# EAGLE design OSSIEPSNew (EAGLE 6.1)

## Sheet 1 of 3
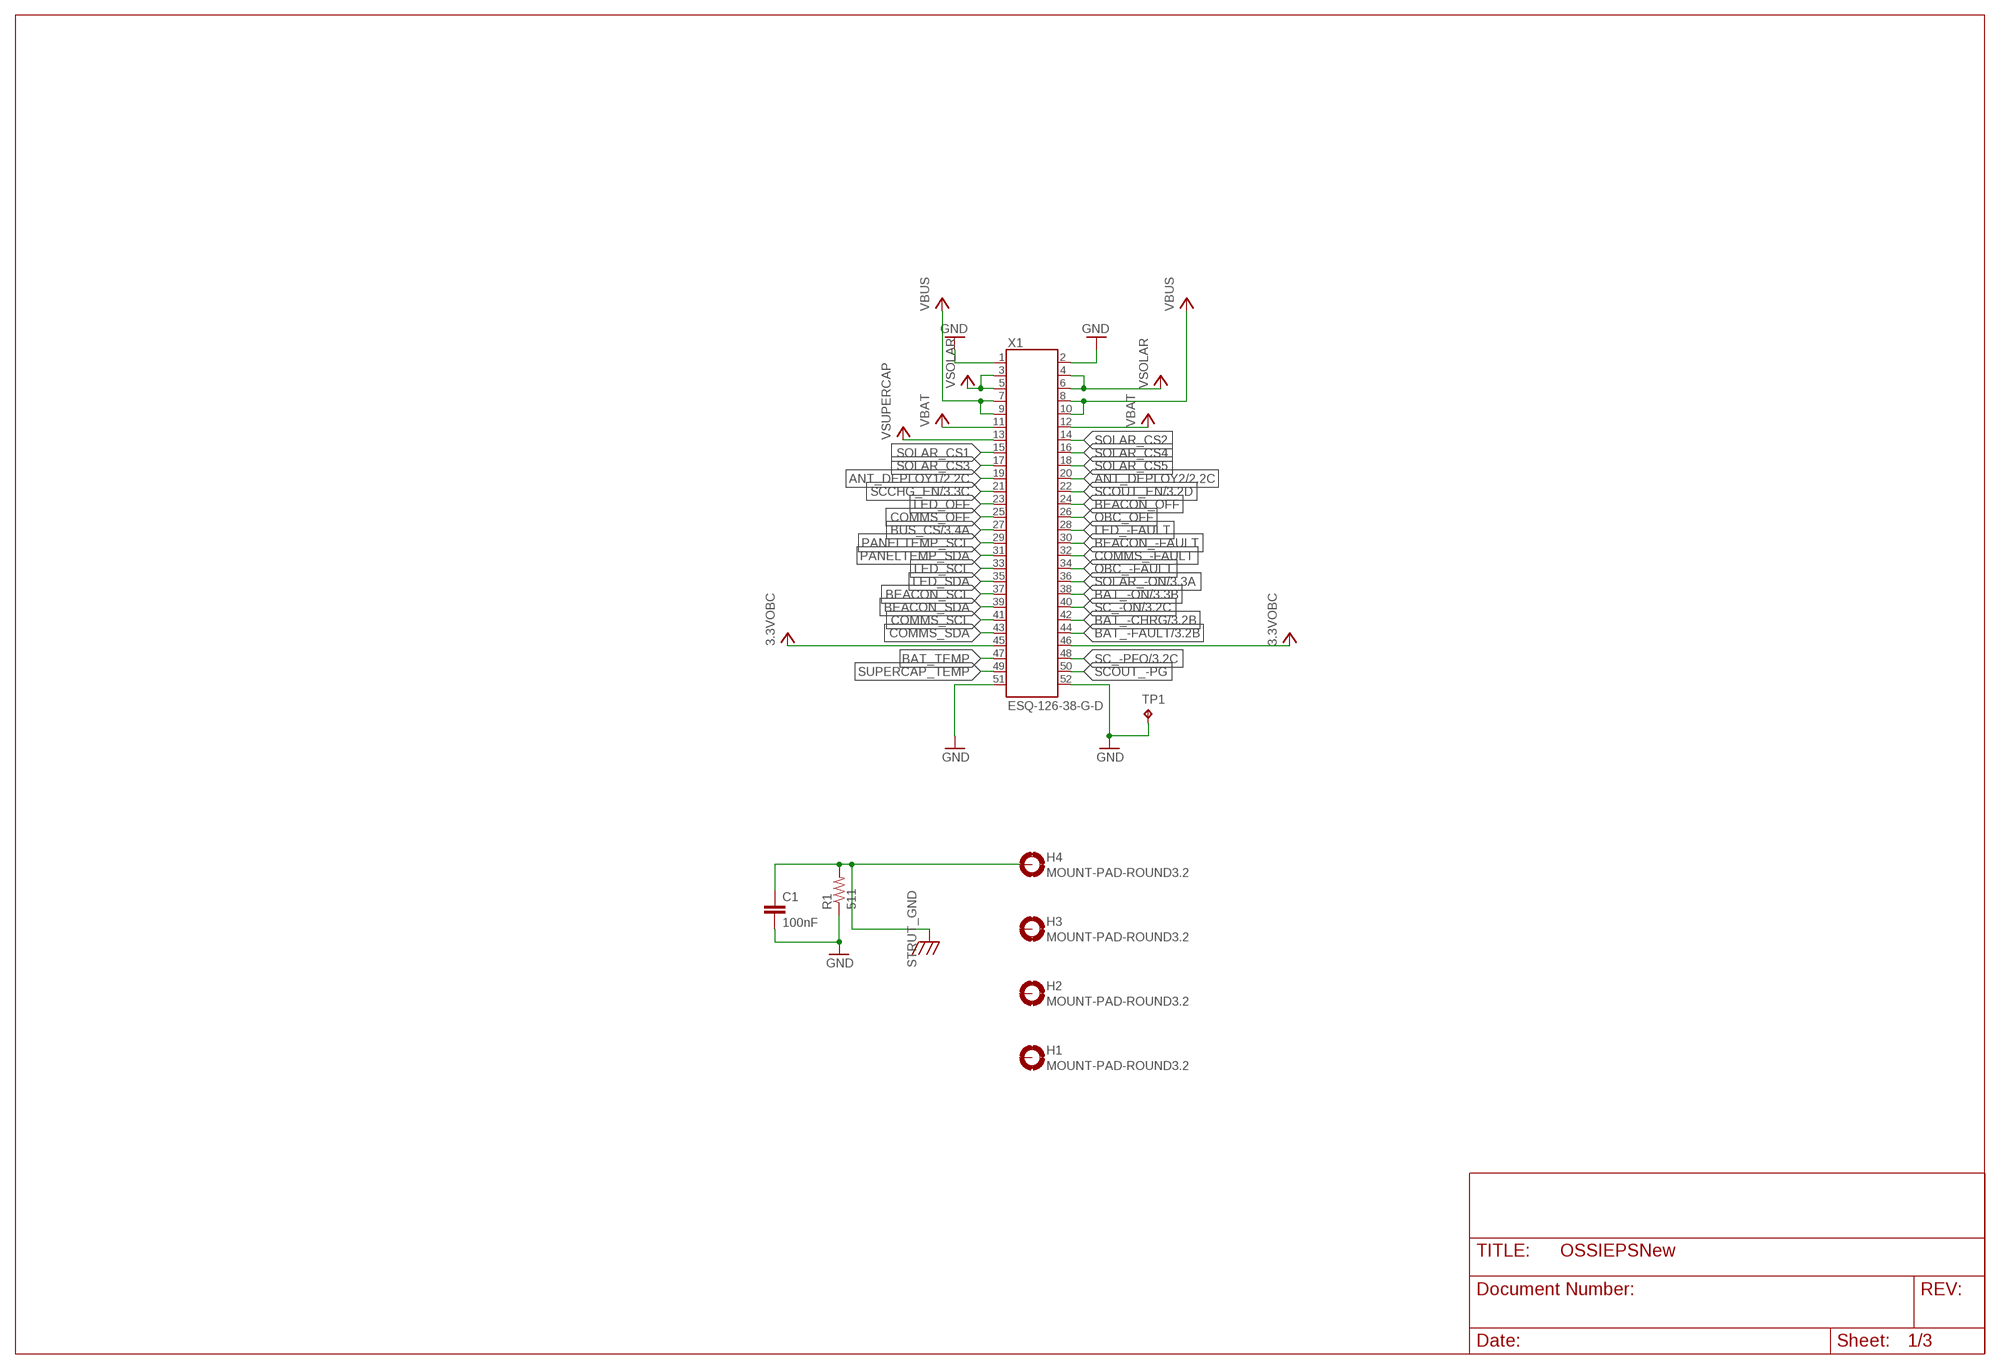
[diagram p0: schematic, sheet 1]

### Parts
C1  100nF  C0805(2012)  [C0805(2012)]
H1  MOUNT-PAD-ROUND3.2  [3.2-PAD-ROUND]
H2  MOUNT-PAD-ROUND3.2  [3.2-PAD-ROUND]
H3  MOUNT-PAD-ROUND3.2  [3.2-PAD-ROUND]
H4  MOUNT-PAD-ROUND3.2  [3.2-PAD-ROUND]
R1  511  RWSL1206  [WSL1206]
TP1  TP  [TP-13]
X1  ESQ-126-38-G-D  [ESQ-126-XX-X-D]

### Nets
3.3VOBC: X1.45 X1.46 ; also sheet 3
ANT_DEPLOY1: X1.19 ; also sheet 2
ANT_DEPLOY2: X1.20 ; also sheet 2
BAT_-CHRG: X1.42 ; also sheet 3
BAT_-FAULT: X1.44 ; also sheet 3
BAT_-ON: X1.38 ; also sheet 3
BAT_TEMP: X1.47
BEACON_-FAULT: X1.30
BEACON_OFF: X1.24
BEACON_SCL: X1.37
BEACON_SDA: X1.39
BUS_CS: X1.27 ; also sheet 3
COMMS_-FAULT: X1.32
COMMS_OFF: X1.25
COMMS_SCL: X1.41
COMMS_SDA: X1.43
GND: C1.2 R1.P$1 TP1.TP X1.1 X1.2 X1.51 X1.52 ; also sheet 2,3
LED_-FAULT: X1.28
LED_OFF: X1.23
LED_SCL: X1.33
LED_SDA: X1.35
OBC_-FAULT: X1.34
OBC_OFF: X1.26
PANELTEMP_SCL: X1.29
PANELTEMP_SDA: X1.31
SC_-ON: X1.40 ; also sheet 3
SC_-PFO: X1.48 ; also sheet 3
SCCHG_EN: X1.21 ; also sheet 3
SCOUT_-PG: X1.50
SCOUT_EN: X1.22 ; also sheet 3
SOLAR_-ON: X1.36 ; also sheet 3
SOLAR_CS1: X1.15
SOLAR_CS2: X1.14
SOLAR_CS3: X1.17
SOLAR_CS4: X1.16
SOLAR_CS5: X1.18
STRUT_GND: C1.1 H4.B3,2(MOUNT) R1.P$2
SUPERCAP_TEMP: X1.49
VBAT: X1.11 X1.12 ; also sheet 2,3
VBUS: X1.7 X1.8 X1.9 X1.10 ; also sheet 3
VSOLAR: X1.3 X1.4 X1.5 X1.6 ; also sheet 3
VSUPERCAP: X1.13 ; also sheet 3
Unconnected: H1.B3,2(MOUNT) H2.B3,2(MOUNT) H3.B3,2(MOUNT)

## Sheet 2 of 3
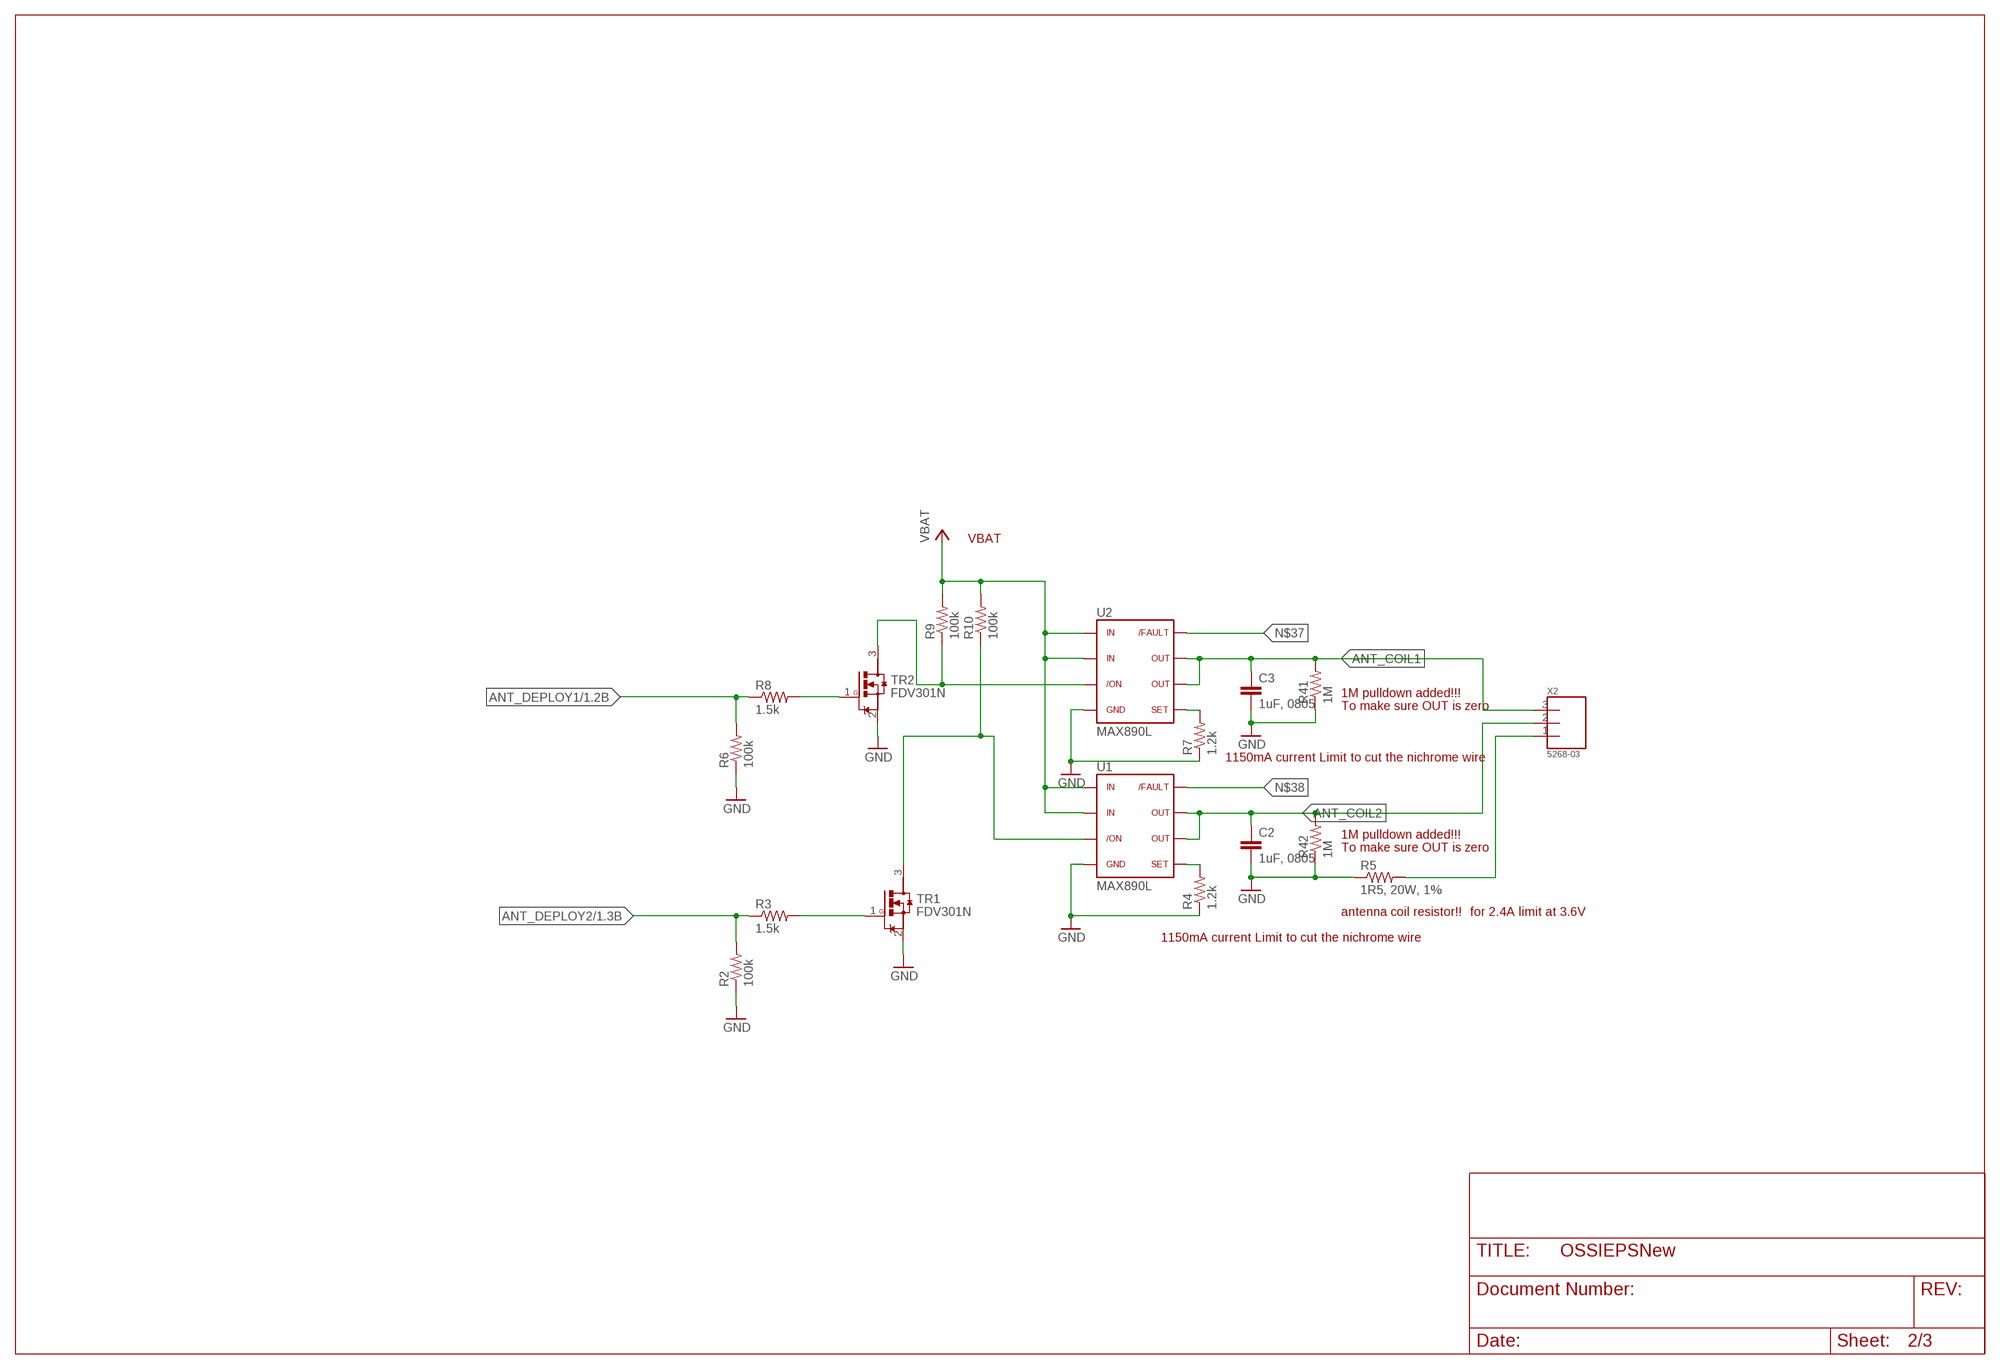
[diagram p1: schematic, sheet 2]

### Parts
C2  1uF, 0805  C0805(2012)  [C0805(2012)]
C3  1uF, 0805  C0805(2012)  [C0805(2012)]
R2  100k  R0603(1608)  [R0603(1608)]
R3  1.5k  R0603(1608)  [R0603(1608)]
R4  1.2k  R0603(1608)  [R0603(1608)]
R5  1R5, 20W, 1%  RPWR263S  [PWR263S-20]
R6  100k  R0603(1608)  [R0603(1608)]
R7  1.2k  R0603(1608)  [R0603(1608)]
R8  1.5k  R0603(1608)  [R0603(1608)]
R9  100k  R0603(1608)  [R0603(1608)]
R10  100k  R0603(1608)  [R0603(1608)]
R41  1M  R0603(1608)  [R0603(1608)]
R42  1M  R0603(1608)  [R0603(1608)]
TR1  FDV301N  [SOT23]
TR2  FDV301N  [SOT23]
U1  MAX890L  [SO8]
U2  MAX890L  [SO8]
X2  5268-03  [5268-03]

### Nets
ANT_COIL1: C3.1 R41.2 U2.6 U2.7 X2.3
ANT_COIL2: C2.1 R42.2 U1.6 U1.7 X2.2
ANT_DEPLOY1: R6.2 R8.1 ; also sheet 1
ANT_DEPLOY2: R2.2 R3.1 ; also sheet 1
GND: C2.2 C3.2 R2.1 R4.1 R5.P$1 R6.1 R7.1 R41.1 R42.1 TR1.2(S) TR2.2(S) U1.4 U2.4 ; also sheet 1,3
N$33: R3.2 TR1.1(G)
N$37: U2.8
N$38: U1.8
N$49: R8.2 TR2.1(G)
N$50: R9.1 TR2.3(D) U2.3
N$51: R10.1 TR1.3(D) U1.3
N$52: R7.2 U2.5
N$53: R4.2 U1.5
N$57: R5.P$2 X2.1
VBAT: R9.2 R10.2 U1.1 U1.2 U2.1 U2.2 ; also sheet 1,3

### Notes on the sheet
- VBAT
- 1M pulldown added!!!
- To make sure OUT is zero
- 1150mA current Limit to cut the nichrome wire
- 1M pulldown added!!!
- To make sure OUT is zero
- antenna coil resistor!! | for 2.4A limit at 3.6V
- 1150mA current Limit to cut the nichrome wire

## Sheet 3 of 3
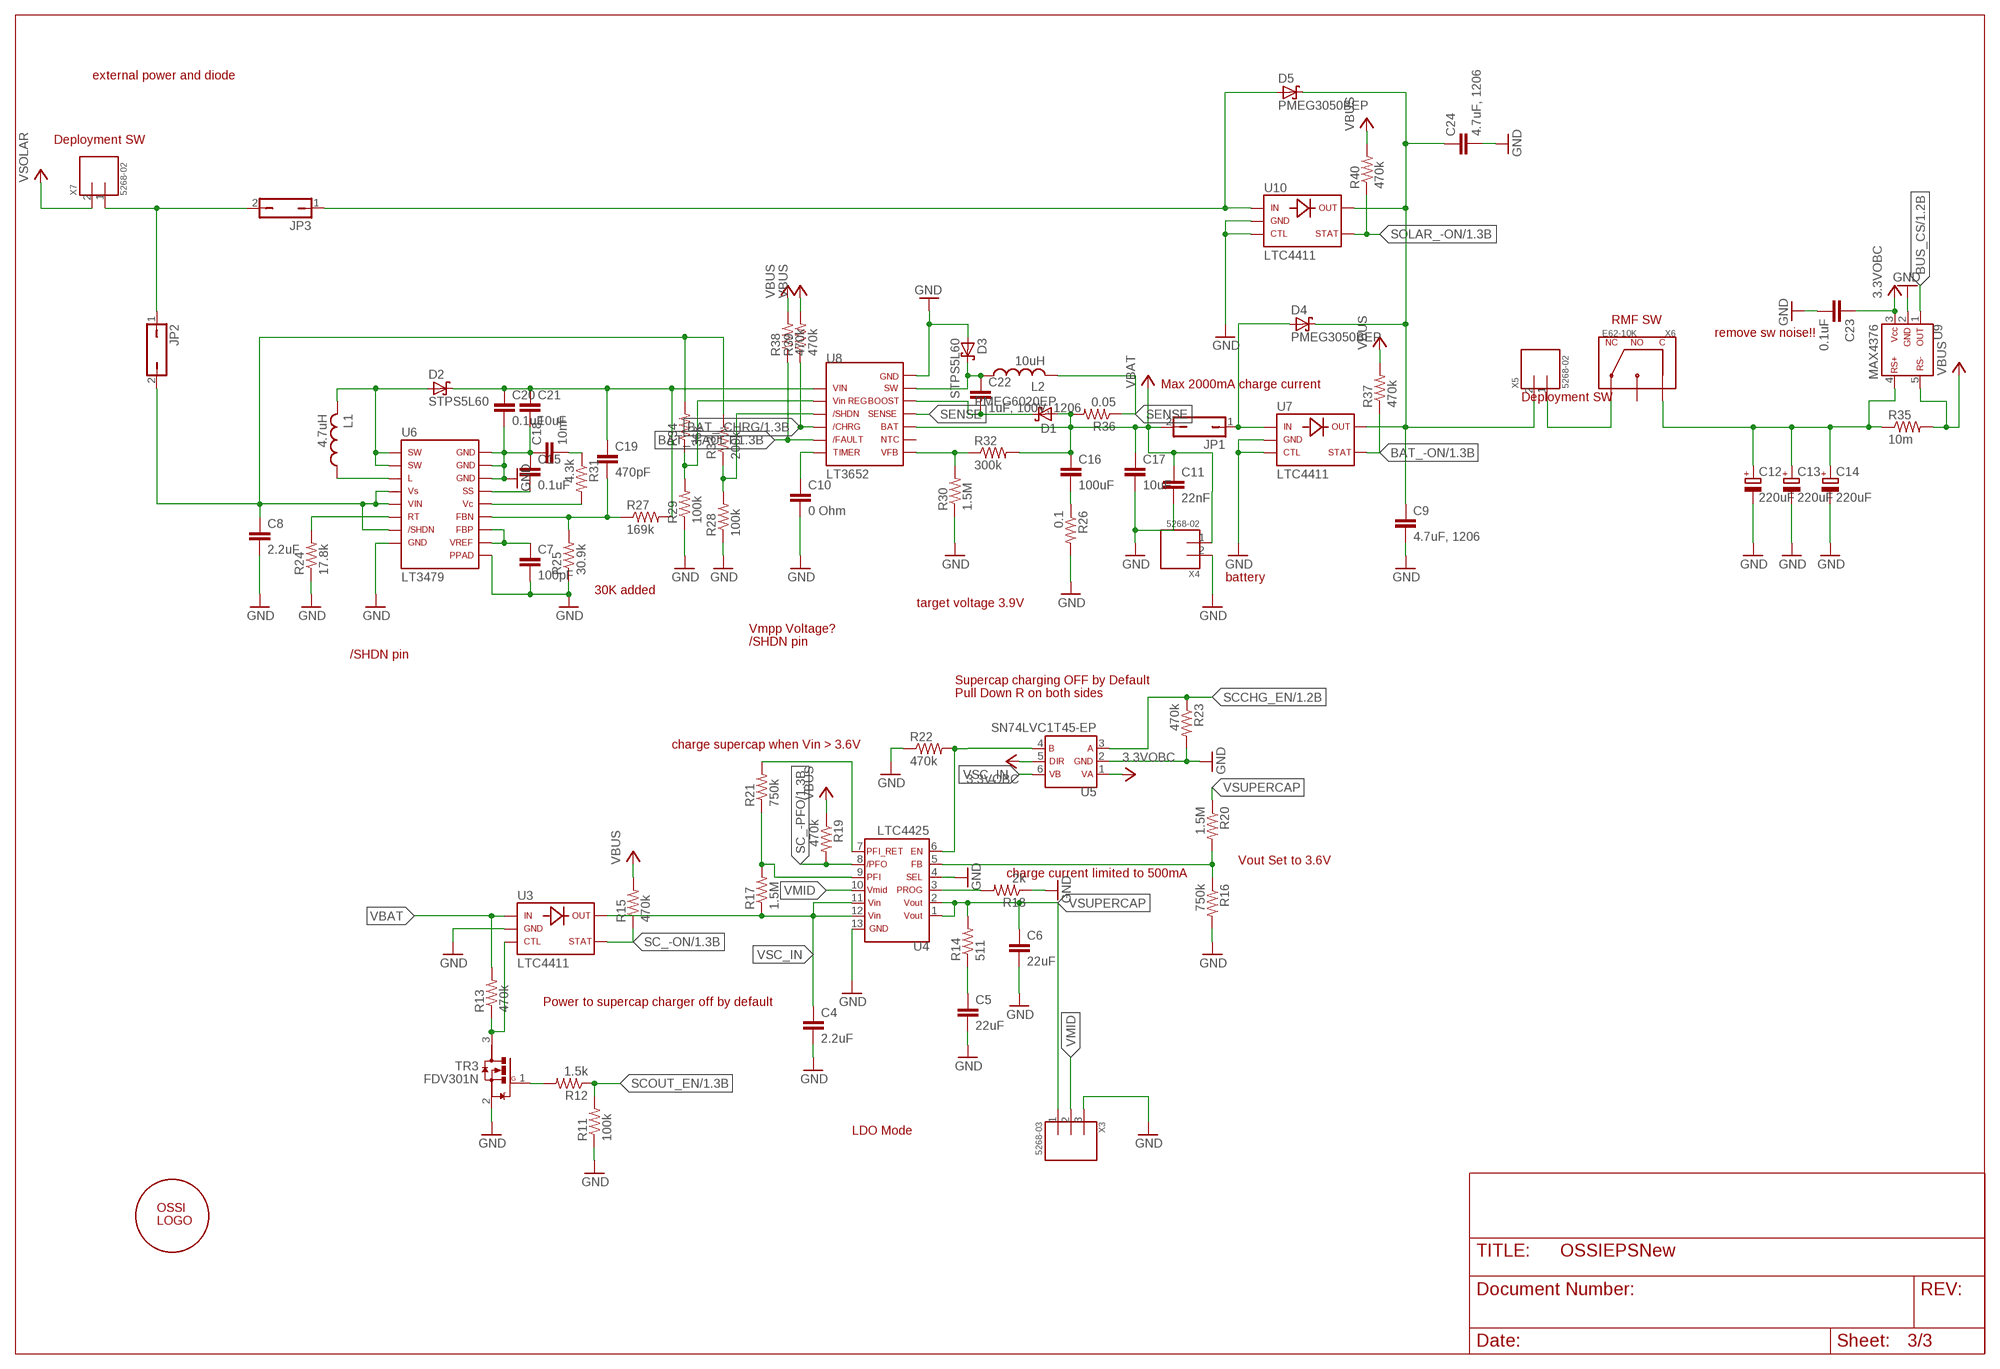
[diagram p2: schematic, sheet 3]

### Parts
C4  2.2uF  C1206(3216)-GCM31  [C1206-GCM31]
C5  22uF  C1210(3225)-GCM32  [C1210-GCM32]
C6  22uF  C1210(3225)-GCM32  [C1210-GCM32]
C7  100pF  C0603(1608)  [C0603(1608)]
C8  2.2uF  C1206(3216)-GCM31  [C1206-GCM31]
C9  4.7uF, 1206  C1206(3216)-GCM31  [C1206-GCM31]
C10  0 Ohm  C0603(1608)  [C0603(1608)]
C11  22nF  C0603(1608)  [C0603(1608)]
C12  220uF  C-TANTAL-Y  [C2917(7343)-Y]
C13  220uF  C-TANTAL-Y  [C2917(7343)-Y]
C14  220uF  C-TANTAL-Y  [C2917(7343)-Y]
C15  0.1uF  C0603(1608)  [C0603(1608)]
C16  100uF  C1210(3225)-TMK325  [C1210-TMK325]
C17  10uF  C1210(3225)-GCM32  [C1210-GCM32]
C18  10nF  C0603(1608)  [C0603(1608)]
C19  470pF  C0603(1608)  [C0603(1608)]
C20  0.1uF  C0603(1608)  [C0603(1608)]
C21  10uF  C1210(3225)-GCM32  [C1210-GCM32]
C22  1uF, 100V, 1206  C0805(2012)  [C0805(2012)]
C23  0.1uF  C0603(1608)  [C0603(1608)]
C24  4.7uF, 1206  C1206(3216)-GCM31  [C1206-GCM31]
D1  PMEG6020EP  [PMEG6020EP]
D2  STPS5L60  [STPS5L60]
D3  STPS5L60  [STPS5L60]
D4  PMEG3050BEP  PMEG6020EP  [PMEG6020EP]
D5  PMEG3050BEP  PMEG6020EP  [PMEG6020EP]
JP1  JP1Q  [JP1]
JP2  JP1Q  [JP1]
JP3  JP1Q  [JP1]
L1  4.7uH  LRLF7030  [RLF7030]
L2  10uH  LRLF12545  [RLF12545]
R11  100k  R0603(1608)  [R0603(1608)]
R12  1.5k  R0603(1608)  [R0603(1608)]
R13  470k  R0603(1608)  [R0603(1608)]
R14  511  RWSL1206  [WSL1206]
R15  470k  R0603(1608)  [R0603(1608)]
R16  750k  R0603(1608)  [R0603(1608)]
R17  1.5M  R0603(1608)  [R0603(1608)]
R18  2k  R0603(1608)  [R0603(1608)]
R19  470k  R0603(1608)  [R0603(1608)]
R20  1.5M  R0603(1608)  [R0603(1608)]
R21  750k  R0603(1608)  [R0603(1608)]
R22  470k  R0603(1608)  [R0603(1608)]
R23  470k  R0603(1608)  [R0603(1608)]
R24  17.8k  R0603(1608)  [R0603(1608)]
R25  30.9k  R0603(1608)  [R0603(1608)]
R26  0.1  RWSL1206  [WSL1206]
R27  169k  R0603(1608)  [R0603(1608)]
R28  100k  R0603(1608)  [R0603(1608)]
R29  100k  R0603(1608)  [R0603(1608)]
R30  1.5M  R0603(1608)  [R0603(1608)]
R31  4.3k  R0603(1608)  [R0603(1608)]
R32  300k  R0603(1608)  [R0603(1608)]
R33  200k  R0603(1608)  [R0603(1608)]
R34  36k  R0603(1608)  [R0603(1608)]
R35  10m  RWSL1206  [WSL1206]
R36  0.05  RWSL1206  [WSL1206]
R37  470k  R0603(1608)  [R0603(1608)]
R38  470k  R0603(1608)  [R0603(1608)]
R39  470k  R0603(1608)  [R0603(1608)]
R40  470k  R0603(1608)  [R0603(1608)]
TR3  FDV301N  [SOT23]
U3  LTC4411  [TSOT23-5]
U4  LTC4425  [MSE]
U5  SN74LVC1T45-EP  [SOT-6DCK]
U6  LT3479  [TSSOP16-FE]
U7  LTC4411  [TSOT23-5]
U8  LT3652  [MSE]
U9  MAX4376  [SOT23-5DBV]
U10  LTC4411  [TSOT23-5]
U$1  OSSILOGORECT  [OSSILOGORECT1005]
X3  5268-03  [5268-03]
X4  5268-02  [5628-02]
X5  5268-02  [5628-02]
X6  E62-10K  [E62-10K]
X7  5268-02  [5628-02]

### Nets
3.3VOBC: C23.1 U5.1 U5.5 U9.3 ; also sheet 1
BAT_-CHRG: R39.1 U8.4 ; also sheet 1
BAT_-FAULT: R38.1 U8.5 ; also sheet 1
BAT_-ON: R37.1 U7.P$4 ; also sheet 1
BUS_CS: U9.1 ; also sheet 1
GND: C4.P$2 C5.P$2 C6.P$2 C7.2 C8.P$2 C9.P$2 C10.2 C11.2 C12.2(-) C13.2(-) C14.2(-) C15.1 C17.P$2 C18.1 C20.2 C21.P$2 C23.2 C24.P$2 D3.A R11.1 R16.2 R18.1 R22.1 R23.2 R24.1 R25.1 R26.P$2 R28.1 R29.1 R30.1 TR3.2(S) U3.P$2 U4.4 U4.13 U5.2 U6.8 U6.14 U6.15 U6.16 U6.PPAD U7.P$2 U7.P$3 U8.13 U9.2 U10.P$2 U10.P$3 X3.3 X4.2 ; also sheet 1,2
N$1: L1.P$1 U6.3
N$2: R29.2 R34.1 U8.2
N$3: C19.1 C20.1 C21.P$1 D2.C R27.2 U8.1
N$4: C16.P$2 R26.P$1
N$5: C15.2 U6.13
N$6: D2.A L1.P$2 U6.1 U6.2
N$7: C18.2 R31.1
N$8: R31.2 U6.12
N$9: C19.2 R25.2 R27.1 U6.11
N$10: C7.1 U6.9 U6.10
N$11: R24.2 U6.6
N$12: R28.2 R33.1 U8.3
N$13: C22.2 D1.C U8.11
N$14: R16.1 R20.2 U4.5
N$16: C22.1 D3.C L2.P$1 U8.12
N$17: R30.2 R32.1 U8.7
N$18: C9.P$1 C24.P$1 D4.C D5.C U7.P$5 U10.P$5 X5.2
N$19: C10.1 U8.6
N$20: R22.2 U4.6 U5.4
N$21: C5.P$1 R14.P$1
N$22: R13.1 TR3.3(D) U3.P$3
N$23: R12.2 TR3.1(G)
N$24: C12.1(+) C13.1(+) C14.1(+) R35.P$1 U9.4 X6.C
N$29: R17.2 R21.1 U4.9
N$31: R21.2 U4.7
N$39: D5.A JP3.1 U10.P$1
N$40: R18.2 U4.3
N$42: D4.A JP1.1 U7.P$1
N$44: C8.P$1 JP2.2 R33.2 R34.2 U6.4 U6.5 U6.7
N$46: JP2.1 JP3.2 X7.1
N$54: X5.1 X6.NC
SC_-ON: R15.1 U3.P$4 ; also sheet 1
SC_-PFO: R19.2 U4.8 ; also sheet 1
SCCHG_EN: R23.1 U5.3 ; also sheet 1
SCOUT_EN: R11.2 R12.1 ; also sheet 1
SENSE: L2.P$2 R36.P$1 U8.10
SOLAR_-ON: R40.1 U10.P$4 ; also sheet 1
VBAT: C11.1 C16.P$1 C17.P$1 D1.A JP1.2 R13.2 R32.2 R36.P$2 U3.P$1 U8.9 X4.1 ; also sheet 1,2
VBUS: R15.2 R19.1 R35.P$2 R37.2 R38.2 R39.2 R40.2 U9.5 ; also sheet 1
VMID: U4.10 X3.2
VSC_IN: C4.P$1 R17.1 U3.P$5 U4.11 U4.12 U5.6
VSOLAR: X7.2 ; also sheet 1
VSUPERCAP: C6.P$1 R14.P$2 R20.1 U4.1 U4.2 X3.1 ; also sheet 1
Unconnected: U8.8 X6.NO

### Notes on the sheet
- external power and diode
- Deployment SW
- RMF SW
- remove sw noise!!
- Max 2000mA charge current
- Deployment SW
- battery
- 30K added
- target voltage 3.9V
- Vmpp Voltage?
- /SHDN pin
- /SHDN pin
- Supercap charging OFF by Default
- Pull Down R on both sides
- charge supercap when Vin > 3.6V
- Vout Set to 3.6V
- charge current limited to 500mA
- Power to supercap charger off by default
- LDO Mode

## Library data of the parts
C1-C11 C15-C24 = OSSI:C
C12-C14 = OSSI:C-TANTAL-Y: TAJY227K010RNJ Taltal Capacitor manufacture: AVX 2917(7343)
D1 D4 D5 = OSSI:PMEG6020EP
D2 D3 = OSSI:STPS5L60: STPS5L60 If: 5A / Vrrm: 60V / Vf: 0.47V @ 5A
H1-H4 = OSSI:MOUNT-PAD-ROUND
JP1-JP3 = OSSI:JP1Q: JUMPER
L1 L2 = OSSI:L
R1-R42 = OSSI:R
TP1 = OSSI:TP
TR1-TR3 = OSSI:FDV301N: FDV301N Digital N channel - FET / Rdson = 5 Ohm / Vgs = 0.7~1.06V / Ids = 220mA
U1 U2 = OSSI:MAX890L: MAX 890L 1.2A, Current-Limited, High-Side P-Channel Switch with Thermal Shutdown BY MAXIM
U3 U7 U10 = OSSI:LTC4411: Linear Techonology LTC4411 ideal diode Small Regulated Forward Voltage (28mV) 2.6A Maximum Forward Current 2.6V to 5.5V Operating Range MOSFET based
U4 = OSSI:LTC4425: LTC4425 Linear SuperCap Charger With Current-Limited Ideal Diode and V/I Monitor
U5 = OSSI:SN74LVC1T45-EP: SN74LVC1T45-EP SINGLE-BIT DUAL-SUPPLY BUS TRANSCEIVER WITH CONFIGURABLE VOLTAGE TRANSLATION AND 3-STATE OUTPUTS
U6 = OSSI:LT3479: LT3479 inverting switching convertor Input Voltage Range: 2.5V to 24V 3A, 42V Internal Switch Efﬁciency Power Conversion: Up to 89% Soft-Start Frequency Set by External Resistor: 200kHz to 3.5MHz Protection Against Input Short Circuits and Hot Plugging
U8 = OSSI:LT3652: LT3652 Battery Charger Power Tracking 2A Battery Charger for Solar Power e Input Voltage Range: 4.95V to 32V (40V Abs Max) Programmable Charge Rate Up to 2A Programmable Float Voltage Up to 14.4V 1MHz Fixed Frequency
U9 = OSSI:MAX4376
U$1 = OSSI:OSSILOGO
X1 = OSSI:ESQ-126-: Samtec ESQ-126-XX-G-D Elevated Sockets Seires ESQ-126-37-G-D ESQ-126-38-G-D ESQ-126-39-G-D
X2 X3 = OSSI:5268-03
X4 X5 X7 = OSSI:5268-02
X6 = OSSI:E62-10K: Cherry E620-10K spdt sw for Remove Before Flight pin

## Board
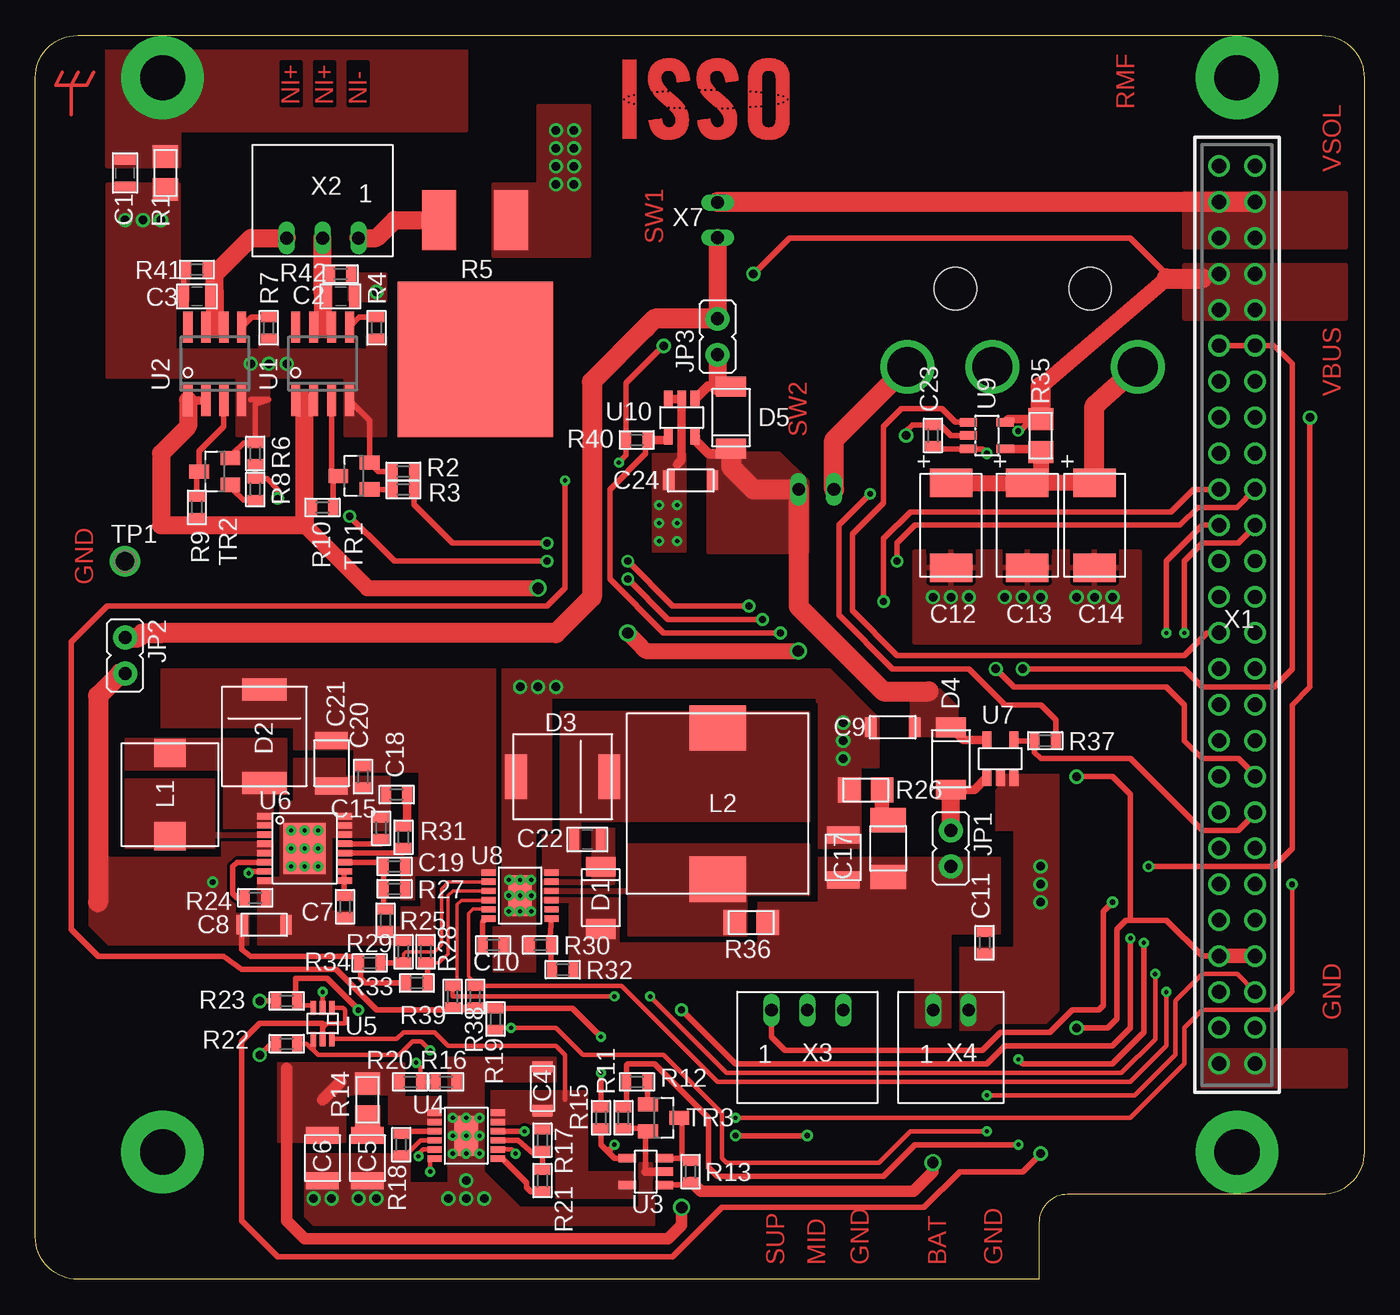
[diagram p3: board, top side]
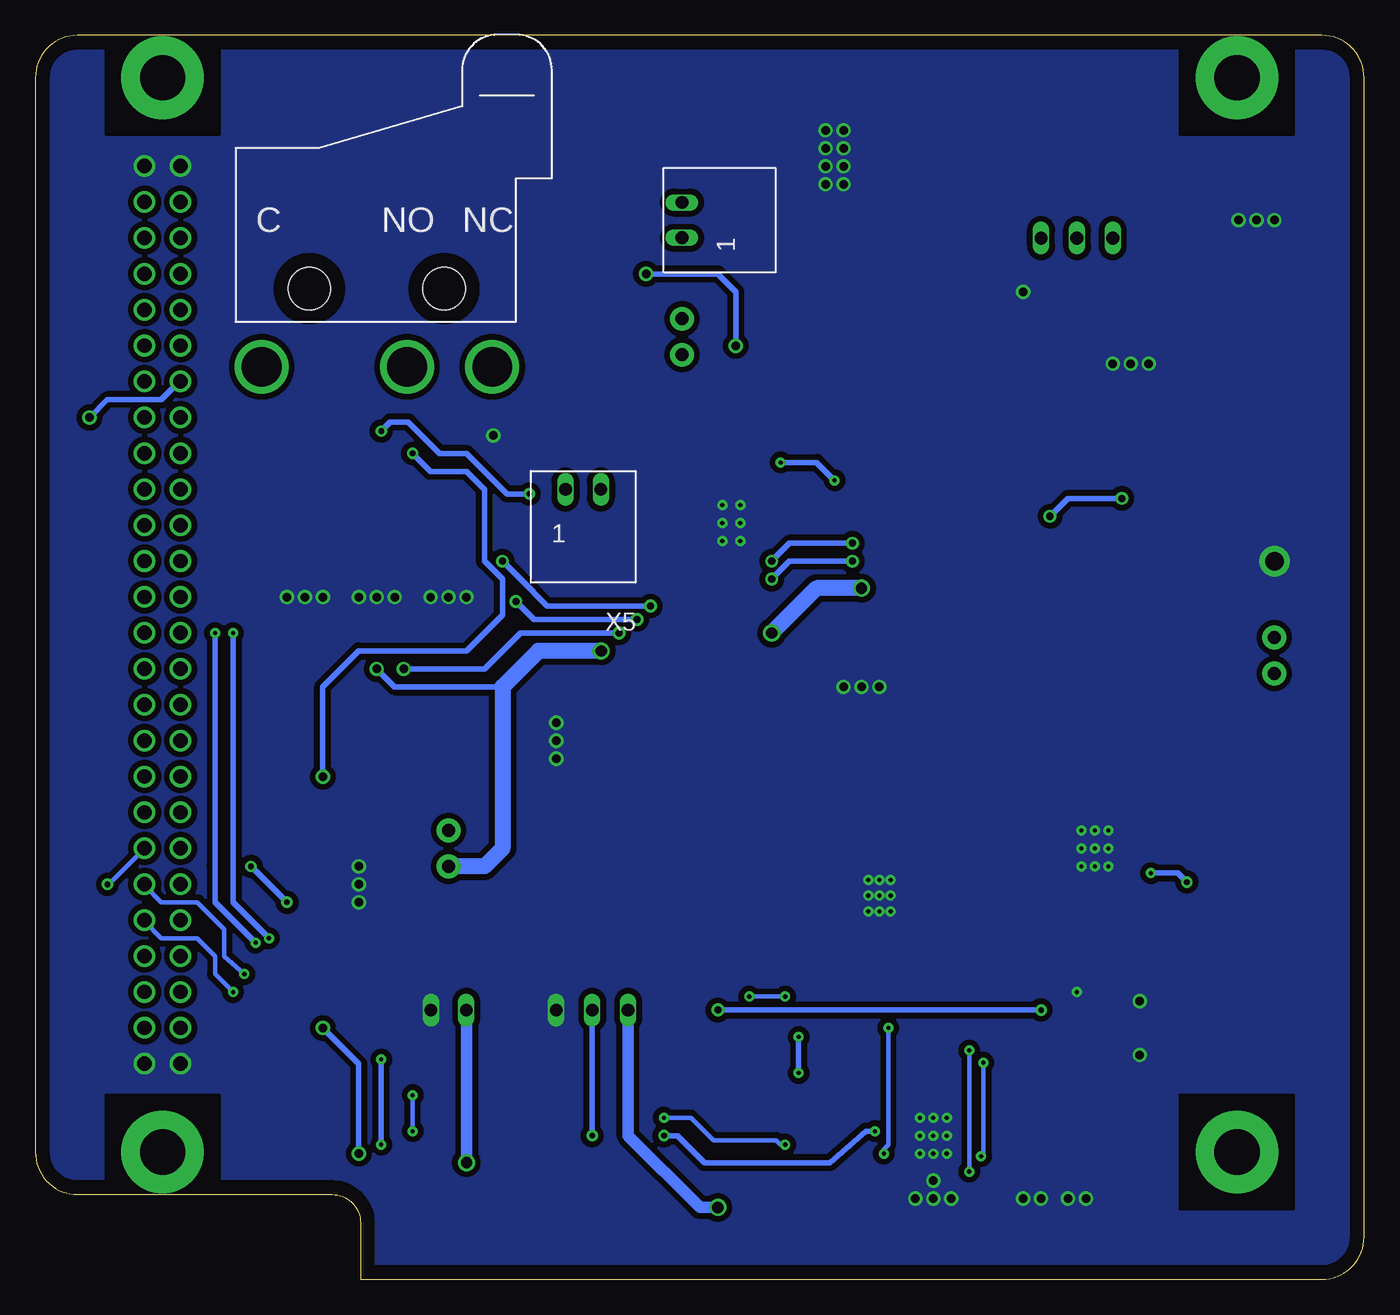
[diagram p4: board, bottom side, seen from below]

Size 94 x 88 mm. Coordinates in mm from the lower left corner, seen from the top.
Outline: 71,0 3,0 arc-90 0,3 0,85 arc-90 3,88 91,88 arc-90 94,85 94,9 arc-90 91,6 73,6 arc90 71,4 71,0
Copper layers (1*16): Top 0.035mm / dielectric 0.8mm / Bottom 0.035mm
Design rules "default": minimum track width 10mil, minimum drill 10mil, track to track 8mil, track to pad 8mil, pad to pad 8mil, via to via 8mil, smd to smd 8mil, copper to edge 40mil, drill to drill 8mil, minimum pad ring 5mil, minimum via ring 8mil, stop-mask expansion 4mil, vias tented up to drill 0mil, thermal gap 10mil

### Footprints (pad centres in the part's own frame; a part is rotated, then mirrored left to right if it is on the bottom)
C0805(2012) = smd 0.7 x 1.5: 1 -0.95,0; 2 0.95,0
C1206-GCM31 = smd 0.8 x 1.4: P$1 -1.55,0; P$2 1.55,0
C1210-GCM32 = smd 1.2 x 2.3: P$1 -1.6,0; P$2 1.6,0
C0603(1608) = smd 0.7 x 1.1: 1 -0.75,0; 2 0.75,0
C2917(7343)-Y = smd 2 x 3: 1 -3,0; 2 3,0
C1210-TMK325 = smd 1.7 x 2.5: P$1 -2,0; P$2 2,0
PMEG6020EP = smd 1.4 x 2.1: A -2.2,0; C 2.2,0
STPS5L60 = smd 1.54 x 3.14: A -3.3,0; C 3.3,0
3.2-PAD-ROUND = drill 3.2 pad 5.842: B3,2 0,0
JP1 = drill 0.914 pad 1.676: 1 0,-1.27; 2 0,1.27
RLF7030 = smd 2 x 2.2: P$1 -2.95,0; P$2 2.95,0
RLF12545 = smd 3.2 x 4: P$1 -5.35,0; P$2 5.35,0
WSL1206 = smd 1.57 x 1.78: P$1 -1.165,0; P$2 1.165,0
R0603(1608) = smd 0.7 x 1.1: 1 -0.75,0; 2 0.75,0
PWR263S-20 = smd 2.4 x 4.23: P$1 -2.54,0; P$2 2.54,0 | smd 11 x 11: TPAD 0,9.865
TP-13 = drill 1.321 pad 2.159: TP 0,0
SOT23 = smd 1 x 1.4: 1 -0.95,-1.1; 2 0.95,-1.1; 3 0,1.1
SO8 = smd 0.65 x 2.2: 1 -1.905,-2.6; 2 -0.635,-2.6; 3 0.635,-2.6; 4 1.905,-2.6; 5 1.905,2.6; 6 0.635,2.6; 7 -0.635,2.6; 8 -1.905,2.6
TSOT23-5 = smd 0.62 x 1.22: P$1 -0.95,-1.31; P$2 0,-1.31; P$3 0.95,-1.31; P$4 0.95,1.31; P$5 -0.95,1.31
MSE = smd 0.45 x 1: 1 -1.625,-2.233; 2 -0.975,-2.233; 3 -0.325,-2.233; 4 0.325,-2.233; 5 0.975,-2.233; 6 1.625,-2.233; 7 1.625,2.233; 8 0.975,2.233; 9 0.325,2.233; 10 -0.325,2.233; 11 -0.975,2.233; 12 -1.625,2.233 | smd 2.845 x 1.65: 13 0,0
SOT-6DCK = smd 0.4 x 1: 1 -0.65,-1.1; 2 0,-1.1; 3 0.65,-1.1; 4 0.65,1.1; 5 0,1.1; 6 -0.65,1.1
TSSOP16-FE = smd 0.45 x 1.1: 1 -2.275,-2.8; 2 -1.625,-2.8; 3 -0.975,-2.8; 4 -0.325,-2.8; 5 0.325,-2.8; 6 0.975,-2.8; 7 1.625,-2.8; 8 2.275,-2.8; 9 2.275,2.8; 10 1.625,2.8; 11 0.975,2.8; 12 0.325,2.8; 13 -0.325,2.8; 14 -0.975,2.8; 15 -1.625,2.8; 16 -2.275,2.8 | smd 3.58 x 2.94: PPAD 0,0
SOT23-5DBV = smd 0.6 x 1.22: 1 -0.95,-1.3; 2 0,-1.3; 3 0.95,-1.3; 4 0.95,1.3; 5 -0.95,1.3
ESQ-126-XX-X-D = drill 1.016 pad 1.524: 1 -1.27,31.75; 2 1.27,31.75; 3 -1.27,29.21; 4 1.27,29.21; 5 -1.27,26.67; 6 1.27,26.67; 7 -1.27,24.13; 8 1.27,24.13; 9 -1.27,21.59; 10 1.27,21.59; 11 -1.27,19.05; 12 1.27,19.05; 13 -1.27,16.51; 14 1.27,16.51; 15 -1.27,13.97; 16 1.27,13.97; 17 -1.27,11.43; 18 1.27,11.43; 19 -1.27,8.89; 20 1.27,8.89; 21 -1.27,6.35; 22 1.27,6.35; 23 -1.27,3.81; 24 1.27,3.81; 25 -1.27,1.27; 26 1.27,1.27; 27 -1.27,-1.27; 28 1.27,-1.27; 29 -1.27,-3.81; 30 1.27,-3.81; 31 -1.27,-6.35; 32 1.27,-6.35; 33 -1.27,-8.89; 34 1.27,-8.89; 35 -1.27,-11.43; 36 1.27,-11.43; 37 -1.27,-13.97; 38 1.27,-13.97; 39 -1.27,-16.51; 40 1.27,-16.51; 41 -1.27,-19.05; 42 1.27,-19.05; 43 -1.27,-21.59; 44 1.27,-21.59; 45 -1.27,-24.13; 46 1.27,-24.13; 47 -1.27,-26.67; 48 1.27,-26.67; 49 -1.27,-29.21; 50 1.27,-29.21; 51 -1.27,-31.75; 52 1.27,-31.75
5268-03 = drill 0.9 long: 1 2.54,0; 2 0,0; 3 -2.54,0
5628-02 = drill 0.9 long: 1 1.25,0; 2 -1.25,0
E62-10K = drill 2.8 pad 3.81: C -17.99,-3.18; NC -1.68,-3.18; NO -7.7,-3.18 | hole 3: -5.08,2.36; -14.61,2.36

### Placement (x,y rotation side)
C1  6.35,78.26 270 top
C2  21.59,69.53 0 top
C3  11.43,69.53 180 top
C4  35.88,13.48 90 top
C5  23.5,8.57 270 top
C6  20.31,8.57 270 top
C7  21.91,26.35 270 top
C8  16.19,25.08 0 top
C9  60.64,39.05 180 top
C10  32.38,23.65 0 top
C11  67.15,23.81 270 top
C12  64.77,53.34 270 top
C13  70.17,53.34 270 top
C14  74.93,53.34 270 top
C15  24.45,31.91 270 top
C16  60.33,30.48 90 top
C17  57.15,29.84 90 top
C18  25.56,34.29 0 top
C19  25.4,29.21 180 top
C20  23.18,35.56 270 top
C21  20.95,36.51 270 top
C22  39.05,31.11 0 top
C23  63.5,59.69 90 top
C24  46.35,56.52 180 top
D1  40.01,26.99 90 top
D2  16.19,38.42 90 top
D3  37.31,35.56 0 top
D4  64.77,36.83 90 top
D5  49.21,60.96 270 top
H1  9,9 0 top
H2  85,9 0 top
H3  85,85 0 top
H4  9,85 0 top
JP1  64.77,30.48 180 top
JP2  6.35,44.13 180 top
JP3  48.26,66.67 0 top
L1  9.53,34.29 90 top
L2  48.26,33.66 270 top
R1  9.21,78.26 90 top
R2  26.04,57.15 0 top
R3  26.04,55.88 180 top
R4  24.13,67.31 90 top
R5  31.11,74.93 180 top
R6  15.56,58.42 270 top
R7  16.51,67.31 90 top
R8  15.56,55.88 270 top
R9  11.43,54.61 270 top
R10  20.32,54.61 180 top
R11  41.59,11.43 90 top
R12  42.56,13.97 0 top
R13  46.35,7.62 270 top
R14  23.5,12.7 90 top
R15  40.01,11.43 90 top
R16  29.06,13.97 0 top
R17  35.88,9.84 270 top
R18  25.88,9.53 90 top
R19  32.54,18.41 270 top
R20  26.52,13.97 0 top
R21  35.88,6.99 270 top
R22  17.78,16.67 0 top
R23  17.78,19.68 180 top
R24  15.56,26.99 180 top
R25  24.77,25.4 90 top
R26  58.74,34.61 180 top
R27  25.4,27.62 0 top
R28  27.62,23.18 270 top
R29  26.04,23.18 270 top
R30  35.72,23.65 0 top
R31  26.04,31.27 270 top
R32  37.31,21.91 0 top
R33  26.99,20.95 180 top
R34  23.65,22.38 180 top
R35  71.12,59.69 90 top
R36  50.64,25.24 0 top
R37  71.44,38.1 0 top
R38  31.11,20 270 top
R39  29.53,20 270 top
R40  42.55,59.37 180 top
R41  11.43,71.44 0 top
R42  21.59,71.12 180 top
TP1  6.35,50.8 0 top
TR1  22.54,56.83 90 top
TR2  12.7,57.15 90 top
TR3  44.45,11.43 270 top
U1  20.32,64.77 0 top
U2  12.7,64.77 0 top
U3  43.18,7.62 90 top
U4  30.48,10.16 270 top
U5  20.32,18.1 180 top
U6  19.05,30.48 270 top
U7  68.26,36.83 0 top
U8  34.29,27.15 270 top
U9  67.31,59.69 270 top
U10  45.72,60.96 180 top
U$1  53.34,86.36 180 top
X1  85,47 0 top
X2  20.32,73.66 0 top
X3  54.61,19.05 180 top
X4  64.77,19.05 180 top
X5  55.24,55.88 180 bottom
X6  60,67.73 0 bottom
X7  48.26,74.93 270 bottom

### Tracks (layer width: path | path; a pad name or v marks a point on that pad's centre or on a via)
3.3VOBC  (via drill 0.4, 0.6)
  Top 0.305: U5.1 21.76,19.2 21.91,19.05 21.91,18.1 20.64,18.1 20.32,17.78 U5.5 | 66.04,58.74 U9.3
  Top 0.406: U9.3 63.7,58.74 C23.1 | X1.45 82.54,22.87 80.01,25.4 | 80.01,25.4 77.47,25.4 | 77.47,25.4 77.15,25.4 | 77.15,25.4 76.52,24.77 76.52,18.41 75.88,17.78 v73.66,17.78 | v71.12,8.89 69.85,7.62 65.41,7.62 62.87,5.08 48.58,5.08 45.09,1.59 17.14,1.59 14.61,4.13 14.61,16.83 15.88,18.1 20.32,18.1 U5.5 | 77.15,25.4 77.47,25.4 | 77.47,25.4 80.01,25.4 | 80.01,25.4 77.47,25.4 | 77.47,25.4 77.47,30.48 77.47,34.29 76.2,35.56 v73.66,35.56 | v67.31,58.42 66.99,58.74 66.04,58.74
  Top 1.016: X1.46 83.83,22.87 83.82,22.86 83.81,22.87 X1.45
  Bottom 0.406: v73.66,17.78 71.12,15.24 v71.12,8.89 | v73.66,35.56 73.66,41.91 71.12,44.45 63.5,44.45 62.23,45.72 60.96,46.99 60.96,49.53 62.23,50.8 62.23,55.88 63.5,57.15 66.04,57.15 v67.31,58.42
ANT_COIL1
  Top 0.305: U2.7 12.64,67.37 12.7,67.31 12.76,67.37 U2.6 | C3.1 12.38,70.17 12.7,69.85
  Top 0.406: R41.2 13.02,71.44
  Top 1.27: 12.7,67.31 12.7,69.85 12.7,71.12 13.02,71.44 15.24,73.66 X2.3
ANT_COIL2
  Top 0.305: U1.7 20.26,67.37 20.32,67.31 20.89,67.31 U1.6 | C2.1 20.32,69.85
  Top 0.406: R42.2 20.32,71.12 20.32,70.48
  Top 1.27: 20.32,67.31 20.32,69.85 20.32,70.48 X2.2
ANT_DEPLOY1  (via drill 0.5)
  Top 0.406: R6.2 R8.1 16.39,56.63 17.14,55.88 v17.14,55.24 | v36.2,50.8 26.04,50.8 25.4,50.8 24.77,51.44 v22.23,53.98 | v41.91,49.53 44.77,46.67 v51.44,46.67 | v60.01,47.94 60.01,52.39 61.91,54.29 80.33,54.29 81.92,55.88 X1.19
  Bottom 0.406: v17.14,55.24 20.32,55.24 20.95,55.24 v22.23,53.98 | v36.2,50.8 40.64,50.8 v41.91,49.53 | v51.44,46.67 58.74,46.67 v60.01,47.94
ANT_DEPLOY2  (via drill 0.5)
  Top 0.406: R2.2 R3.1 26.79,54.81 29.53,52.07 v36.2,52.07 | v41.91,50.8 45.09,47.62 v50.48,47.62 | v60.96,50.8 60.96,52.07 62.23,53.34 80.96,53.34 82.23,54.61 84.99,54.61 X1.20
  Bottom 0.406: v36.2,52.07 38.1,52.07 40.64,52.07 v41.91,50.8 | v50.48,47.62 57.78,47.62 59.69,49.53 v60.96,50.8
BAT_-CHRG  (via drill 0.3)
  Top 0.254: U8.4 30.16,26.82 29.84,26.51 29.84,21.11 29.53,20.8 R39.1
  Top 0.305: v79.21,21.59 79.21,16.98 76.83,14.61 69.85,14.61 48.9,14.61 v43.5,20 | v40.96,20 29.53,20 R39.1
  Bottom 0.305: X1.42 86.27,27.85 85.09,26.67 82.55,26.67 80.64,24.77 80.64,22.86 v79.21,21.59 | v43.5,20 v40.96,20
BAT_-FAULT  (via drill 0.3)
  Top 0.254: R38.1 31.11,20.95 30.64,21.43 30.64,25.88 30.96,26.19 32.17,26.19 U8.5
  Top 0.305: v80.01,20.32 80.01,16.51 77.47,13.97 69.85,13.97 48.26,13.97 41.48,20.75 R38.1
  Bottom 0.305: X1.44 86.27,25.31 85.09,24.13 82.55,24.13 81.28,22.86 81.28,21.59 v80.01,20.32
BAT_-ON
  Top 0.406: U7.P$4 69.25,38.1 R37.1 70.69,37.26 71.12,36.83 72.39,36.83 77.47,36.83 81.28,33.02 82.55,31.75 85.09,31.75 86.27,32.93 X1.38
BUS_CS
  Top 0.406: U9.1 65.09,60.64 64.14,61.59 61.28,61.59 60.01,60.33 60.01,54.93 57.78,52.7 57.78,47.31 60.96,44.13 81.28,44.13 82.87,45.72 83.82,45.72 83.81,45.73 X1.27
GND  (via drill 0.3, 0.6)
  Top 0.305: U4.4 27.26,9.84 26.19,8.78 R18.1 | U5.2 v20.32,20.32
  Top 0.406: U1.4 23.64,60.75 TR1.2 24.27,57.15 R2.1 | U9.2 64.77,59.69 64.02,60.44 C23.2 62.03,60.44 61.59,60.01 v61.59,59.69 | 15.24,62.23 16.51,62.23 15.56,61.91 R6.1 14.72,59.17 13.97,58.42 13.97,58.27 TR2.2 | 43.18,7.62 43.18,10.48 TR3.2 43.35,10.68 R11.1 | R23.2 v15.88,19.68 | R22.1 16.67,16.67 v15.88,15.88 | R41.1 10.48,71.44 10.48,69.85 10.16,69.85 10.16,69.53 C3.2
  Top 0.6: U3.P$2 43.18,7.62
  Top 0.61: 45.72,62.23 45.56,62.23 45.52,62.27 U10.P$3 45.68,62.27 45.72,62.23 | 45.72,62.23 U10.P$2 | 45.72,62.23 45.72,57.94 45.4,57.63
  other vias: 16.51,64.77 17.78,64.77 15.24,64.77 24.13,69.85 36.83,78.74 38.1,78.74 38.1,77.47 36.83,77.47 19.05,30.48 19.05,29.21 19.05,31.75 34.29,27.15 34.29,28.26 34.29,26.04 30.48,10.16 30.48,8.89 30.48,11.43 20,31.75 20,30.48 20,29.21 18.1,29.21 18.1,30.48 18.1,31.75 31.43,11.43 31.43,10.16 31.43,8.89 29.53,8.89 29.53,10.16 29.53,11.43 33.5,28.26 35.08,28.26 33.5,27.15 35.08,27.15 33.5,26.04 35.08,26.04 45.4,53.5 44.13,53.5 71.12,29.21 71.12,26.67 71.12,27.94 57.15,39.37 57.15,38.1 57.15,36.83 34.29,41.91 35.56,41.91 36.83,41.91 6.35,74.93 7.62,74.93 8.89,74.93 36.83,80.01 38.1,80.01 36.83,81.28 38.1,81.28 44.13,54.77 45.4,54.77 44.13,52.23 45.4,52.23 63.5,48.26 64.77,48.26 66.04,48.26 68.58,48.26 69.85,48.26 71.12,48.26 73.66,48.26 74.93,48.26 76.2,48.26 30.48,5.71 31.75,5.71 29.21,5.71 30.48,6.99 24.13,5.71 22.86,5.71 20.95,5.71 19.68,5.71
  pour Bottom (isolate 0.406, no thermals): 94,88 94,6 71,6 71,0 0,0 0,88
  pour Top (no thermals): 10.16,77.47 10.16,70.8 10.79,70.8 10.79,69.22 9.84,69.22 9.84,65.72 15.88,65.72 15.88,66.67 17.14,66.67 17.14,65.72 23.5,65.72 23.5,66.67 24.77,66.67 24.77,59.69 21.91,59.69 21.91,63.82 16.51,63.82 16.51,59.69 14.29,59.69 14.29,63.82 5.08,63.82 5.08,77.47
  pour Top (no thermals): 22.23,69.22 22.23,71.12 24.77,71.12 24.77,69.22
  pour Top (isolate 0.406, no thermals): 39.21,83.03 39.21,72.39 32.38,72.39 32.38,77.47 35.56,77.47 35.56,83.03
  pour Top (no thermals): 25.08,35.56 21.91,35.56 21.91,36.83 18.26,36.83 18.26,33.81 17.3,33.81 17.3,28.42 15.72,28.42 15.72,23.65 28.26,23.65 28.26,28.1 27.3,28.1 27.3,26.35 25.88,26.35 25.88,24.92 22.54,24.92 22.54,26.04 20.95,26.04 20.95,31.27 25.08,31.27
  pour Top (no thermals): 35.4,21.75 32.38,21.75 32.38,24.92 33.02,24.92 33.02,43.18 50.32,43.18 50.32,41.12 36.51,41.12 36.51,31.75 35.4,31.75
  pour Top (no thermals): 55.4,30.48 58.42,30.48 58.42,36.2 59.69,36.2 59.69,39.69 56.2,43.18 49.53,43.18 49.53,41.12 55.24,41.12 55.24,40.8 55.4,40.8
  pour Top (no thermals): 46.04,58.42 46.04,51.44 43.66,51.44 43.66,58.42
  pour Top (isolate 0.406, no thermals): 65.41,23.5 69.22,23.5 69.22,31.75 67.94,31.75 67.94,35.72 72.39,35.72 72.39,17.62 65.41,17.62
  pour Top: 62.23,51.44 78.11,51.44 78.11,45.09 62.23,45.09
  pour Top (no thermals): 19.05,4.45 19.05,8.89 26.51,8.89 26.51,6.81 29.21,6.81 29.21,15.7 36.83,15.7 36.83,13.97 31.75,13.97 31.75,7.62 34.29,5.08 42.71,5.08 42.71,8.26 43.65,8.26 43.65,5.71 43.8,5.71 43.8,3.81 19.68,3.81
  pour Top (no thermals): 82.55,16.19 92.71,16.19 92.71,13.65 82.55,13.65
N$1
  pour Top (no thermals): 6.35,35.4 12.7,35.4 12.7,31.59 16.67,31.59 16.67,31.27 12.7,31.27 12.7,30.48 6.35,30.48
N$2
  Top 0.254: R29.2 26.04,23.02 26.19,23.18 28.26,23.18 28.73,23.65 28.73,27.62 29.21,28.1 32.17,28.1 U8.2
  Top 0.406: R34.1 25.99,22.38 R29.2
N$3
  pour Top (no thermals): 8.89,43.18 8.89,39.05 18.26,39.05 18.26,37.47 22.54,37.47 22.54,35.88 27.15,35.88 27.15,29.84 25.88,29.84 25.88,26.83 26.83,26.83 26.83,28.57 32.54,28.57 32.54,43.18
N$4
  Top 1.016: R26.P$1 59.9,32.9 C16.P$2
N$5
  Top 0.406: U6.13 24.45,30.8 C15.2
N$6
  pour Top (no thermals): 6.35,38.26 6.35,36.04 13.34,36.04 13.34,31.91 16.83,31.91 16.83,34.29 17.78,34.29 17.78,38.26
N$7
  Top 0.61: R31.1 26.31,32.02 C18.2
N$8
  Top 0.406: U6.12 26.04,30.16 R31.2
N$9
  Top 0.406: U6.11 24.65,29.5 C19.2 R27.1 24.65,26.15 R25.2
N$10
  Top 0.406: U6.10 U6.9 21.85,27.1 C7.1
N$11
  Top 0.406: U6.6 14.27,29.5 13.97,29.21 13.97,27.3 14.29,26.99 R24.2
N$12
  Top 0.254: U8.3 29.54,27.47 29.21,27.15 29.21,23.02 28.57,22.38 27.67,22.38 R28.2
  Top 0.406: R33.1 27.74,22.31 R28.2
N$13
  pour Top (no thermals): 35.88,27.94 40.96,27.94 40.96,31.91 39.37,31.91 39.37,28.26 35.88,28.26
N$14  (via drill 0.3)
  Top 0.305: R16.1 R20.2 27.27,14.99 v26.93,15.32 | v27.1,8.71 27.1,8.87 27.42,9.19 28.23,9.19 28.24,9.19 U4.5
  Bottom 0.305: v26.93,15.32 26.93,8.87 v27.1,8.71
N$16
  pour Top (no thermals): 35.88,28.57 35.88,31.43 37.15,31.43 37.15,40.16 54.77,40.16 54.77,32.38 38.58,32.38 38.58,28.57
N$17
  Top 0.406: U8.7 36.39,23.73 R30.2 36.47,22 R32.1
N$18
  Top 0.61: U7.P$5 65.66,38.14 D4.C
  Top 0.7: U10.P$5 46.67,59.38 47.62,58.42 48.87,58.42 D5.C
  Top 1.422: D5.C 49.21,57.47 49.53,57.15 50.8,55.88 X5.2 53.99,47.6 60.01,41.59 63.18,41.59
  pour Top (no thermals): 61.91,38.42 61.91,41.75 63.98,41.75 65.25,40.48 65.25,38.42
  pour Top (no thermals): 47.62,58.42 47.62,51.44 54.61,51.44 54.61,56.42 52.61,58.42
N$19
  Top 0.406: C10.1 31.64,25.29 31.75,25.4 31.87,25.52 U8.6
N$20  (via drill 0.3)
  Top 0.305: R22.2 19.21,16.67 20,15.88 | 20,15.88 25.72,15.88 26.67,16.83 27.3,16.83 v27.94,16.19 | U4.6 27.98,8.54 27.94,8.57 27.94,7.94 v27.94,7.62 | 20,15.88 19.67,16.19 U5.4
  Bottom 0.305: v27.94,16.19 v27.94,7.62
N$21
  Top 0.305: C5.P$1 23.5,11.43 R14.P$1
N$22
  Top 0.406: TR3.3 45.72,11.43 45.73,10.47 45.73,8.88 45.72,8.57 | U3.P$3 45.72,8.57 | 45.72,8.57 46.16,8.57 | 46.16,8.57 R13.1 46.16,8.57 | 45.72,8.57 46.16,8.57
N$23
  Top 0.406: TR3.1 43.3,12.38 R12.2
N$24
  Top 0.61: U9.4 70.91,58.74 R35.P$1
  Top 1.143: C12.1 C13.1 71.12,56.34 | C14.1 71.12,56.34 | R35.P$1 71.12,56.34
  Top 1.422: C14.1 74.93,61.81 X6.C
N$29
  Top 0.406: R21.1 35.67,7.74 35.56,7.62 35.88,7.94 R17.2 35.67,8.89 35.56,8.89 35.24,8.89 34.14,9.84 U4.9 32.59,9.84
N$31
  Top 0.406: U4.7 33.06,8.54 34.77,6.83 34.77,6.51 35.08,6.19 35.83,6.19 R21.2
N$33
  Top 0.406: TR1.1 24.34,55.88 R3.2
N$39
  Top 0.7: D5.A 48.26,63.16 47.56,63.16 U10.P$1
  Top 1.27: JP3.1 48.26,63.16
N$40
  Top 0.406: U4.3 26.56,10.48 R18.2
N$42
  Top 0.61: D4.A 66.42,34.63 U7.P$1
  Top 1.27: JP1.1 D4.A
N$44  (via drill 0.3, 0.4)
  Top 0.406: U6.7 15.2,28.86 v15.08,28.73 | v12.54,28.1 12.7,27.94 | C8.P$1 14.61,25.05 14.61,23.34 15.24,22.86 22.86,22.86 22.86,22.7 R34.2 23.02,22.27 23.02,21.27 23.34,20.95 R33.2
  Top 1.422: JP2.2 6.03,42.86 4.45,41.27 4.45,26.67
  Bottom 0.406: v15.08,28.73 13.18,28.73 v12.54,28.1
  pour Top (no thermals): 16.83,30.96 16.83,30 14.13,30 14.13,25.88 15.08,25.88 15.08,23.65 5.17,23.65 3.81,25.02 3.81,29.84 13.18,29.84 13.18,30.96
N$46
  Top 1.27: X7.1 JP3.2
  Top 1.422: JP3.2 43.81,67.94 43.18,67.31 39.37,63.5 39.37,48.26 36.83,45.72 8.89,45.72 7.62,45.72 7.3,45.4 JP2.1
N$49
  Top 0.406: R8.2 14.72,55.13 13.97,55.88 13.97,56.03 TR2.1
N$50
  Top 0.406: R9.1 11.43,56.98 TR2.3 11.6,58.59 12.7,59.69 13.34,60.33 U2.3
N$51
  Top 0.406: U1.3 20.95,57.3 TR1.3 | TR1.3 21.44,56.8 | R10.1 21.07,56.57 TR1.3
N$52
  Top 0.406: U2.5 14.61,67.31 U2.5 | U2.5 15.29,68.06 R7.2
N$53
  Top 0.406: U1.5 22.91,68.06 R4.2
N$54
  Top 1.422: X5.1 56.49,59.37 X6.NC
N$56
  cutout Bottom: 5,88 5,81 13,81 13,88
  cutout Bottom: 81,88 81,81 89,81 89,88
  cutout Bottom: 81,13 81,6 89,6 89,13
  cutout Bottom: 5,13 5,5 13,5 13,13
N$57
  Top 1.27: X2.1 24.13,73.66 25.4,74.93 27.94,74.93 R5.P$2
N$58
  Top 0.254: 2.54,82.39 2.54,84.3
N$59
  Top 0.254: 2.54,84.45 3.65,84.45 4.13,85.41 | 2.54,84.45 1.43,84.45 1.91,85.41 | 2.54,84.45 3.02,85.41
SC_-ON  (via drill 0.3, 0.4)
  Top 0.305: v49.53,11.43 75.56,11.43 77.47,11.43 80.01,13.97 81.28,15.24 81.28,17.78 82.55,19.05 87.63,19.05 88.9,20.32 v88.9,27.94
  Top 0.406: R15.1 40.01,9.53 40.64,8.89 | 40.96,8.57 U3.P$4 40.96,8.57 | 40.96,8.57 40.64,8.89 | 40.96,8.57 40.64,8.89 | 40.64,8.89 40.64,9.21 v40.96,9.53
  Bottom 0.305: v40.96,9.53 41.27,9.53 41.59,9.84 46.04,9.84 47.62,11.43 v49.53,11.43 | v88.9,27.94 88.82,27.94 X1.40
SC_-PFO  (via drill 0.3)
  Top 0.305: U4.8 33.68,9.19 v33.97,8.89 | R19.2 32.54,17.62 32.7,17.46 32.38,17.78 33.02,17.78 v33.66,17.78 36.83,17.78 38.73,15.88 44.45,15.88 48.58,11.75 48.58,8.57 48.9,8.26 55.88,8.26 59.69,8.26 61.91,10.48 v67.31,10.48 | v67.31,13.02 77.79,13.02 80.64,15.88 80.64,19.68 82.55,21.59 85.01,21.59 X1.48
  Bottom 0.305: v33.97,8.89 33.97,9.21 33.66,9.53 v33.66,17.78 | v67.31,10.48 v67.31,13.02
SCCHG_EN  (via drill 0.3, 0.4, 0.5)
  Top 0.305: 19.68,19.37 19.67,19.35 U5.3 19.5,19.37 18.73,19.37 18.62,19.48 18.62,19.6 R23.1 18.41,19.68
  Top 0.406: X1.21 82.56,53.35 80.01,50.8 v80.01,45.72 | v77.47,24.13 77.47,17.78 76.2,16.51 68.58,16.51 67.31,15.24 49.53,15.24 v45.72,19.05 | 18.62,19.48 18.62,19.89 | v22.86,19.05 20.64,21.27 18.41,21.27 18.41,20.64 18.41,19.68
  Bottom 0.406: v80.01,45.72 80.01,29.21 80.01,26.67 v77.47,24.13 | v45.72,19.05 v22.86,19.05
SCOUT_EN  (via drill 0.3)
  Top 0.406: X1.22 86.27,53.25 85.09,52.07 82.55,52.07 81.28,50.8 v81.28,45.72 | R11.2 41.8,12.18 R12.1 41.8,15.13 41.91,15.24 43.81,15.24 44.45,14.61 46.99,12.06 47.62,11.43 47.62,7.94 48.26,7.3 60.01,7.3 62.23,9.53 62.87,9.53 v69.53,9.53 | v69.53,15.56 69.85,15.24 73.66,15.24 76.2,15.24 78.42,17.46 78.42,22.23 78.42,22.54 v78.42,23.81
  Bottom 0.406: v69.53,9.53 69.53,15.24 v69.53,15.56 | v81.28,45.72 81.28,29.21 81.28,26.67 v78.42,23.81
SENSE
  pour Top (no thermals): 54.77,30.8 54.77,27.15 50.32,27.15 50.32,24.29 41.91,24.29 41.91,27.3 35.88,27.3 35.88,27.62 41.91,27.62 41.91,30.8
SOLAR_-ON  (via drill 0.5, 0.6)
  Top 0.305: 43.5,59.37 44.73,59.37 43.5,59.37 | 43.5,59.37 43.18,59.69 | 43.5,59.37 43.18,59.69 | 43.18,59.69 43.18,59.05
  Top 0.406: 43.18,59.05 43.18,58.42 40.64,55.88 40.64,49.53 44.45,45.72 v52.7,45.72 | v67.94,43.18 69.22,41.91 80.01,41.91 81.28,40.64 81.28,38.1 82.55,36.83 85.09,36.83 86.36,35.56 X1.36
  Top 0.61: R40.1 44.73,59.37 U10.P$4
  Bottom 0.406: v52.7,45.72 59.69,45.72 62.23,43.18 v67.94,43.18
STRUT_GND
  pour Top (no thermals): 5.08,87.63 30.48,87.63 30.48,81.28 10.16,81.28 10.16,78.74 5.08,78.74
VBAT  (via drill 0.6, 0.8)
  Top 0.4: X1.11 X1.12
  Top 0.406: R9.2 11.43,53.34 | R10.2 19.05,53.34 | U3.P$1 46.16,6.67 R13.2 | X1.11 87.62,66.05 88.9,64.77 88.9,44.45 88.9,43.18 87.63,41.91 82.55,41.91 81.28,43.18 v69.85,43.18
  Top 0.61: U2.1 U2.2 | U1.1 19.05,62.17 U1.2
  Top 0.813: R13.2 46.47,6.87 46.99,6.35 47.1,6.24 57.03,6.24 62.12,6.24 62.23,6.35 63.5,7.62 v63.5,8.26
  Top 1.143: 19.05,53.34 23.5,48.9 v35.56,48.9 | v41.91,45.72 42.55,45.09 43.18,44.45 v53.98,44.45
  Top 1.27: U2.1 10.79,60.33 8.89,58.42 8.89,53.34 11.43,53.34 19.05,53.34 19.05,53.98 19.05,62.17
  Bottom 0.254: 63.5,19.05 X4.1
  Bottom 0.406: v69.85,43.18 68.58,41.91 60.96,41.91
  Bottom 0.813: 63.5,19.05 v63.5,8.26
  Bottom 1.143: v35.56,48.9 38.73,48.9 v41.91,45.72 | v53.98,44.45 58.42,44.45 60.96,41.91 60.96,30.48 62.23,29.21 JP1.2
  pour Top (no thermals): 35.88,26.99 35.88,26.67 37.78,26.67 37.78,21.27 62.23,21.27 62.23,17.78 64.77,17.78 64.77,21.27 64.77,21.27 64.77,24.45 68.26,24.45 68.26,29.84 55.4,29.84 55.4,26.67 51.12,26.67 51.12,23.81 41.27,23.81 41.27,26.99
VBUS  (via drill 0.3, 0.4, 0.6)
  Top 0.305: 40.01,12.06 R15.2
  Top 0.406: R39.2 30.48,19.25 | 30.48,19.25 R38.2 32.46,19.25 R19.1 37.98,19.16 v40.01,17.14 | v44.45,66.04 41.8,63.38 R40.2 41.8,58.3 v41.27,57.78 | v50.8,71.12 53.34,73.66 77.47,73.66 80.01,71.12 80.01,70.8 | v37.47,56.52 37.47,48.9 36.2,47.62 5.08,47.62 3.17,45.72 2.54,45.09 2.54,24.77 4.45,22.86 13.34,22.86 14.61,21.91 21.27,21.91 22.86,20.32 24.13,19.05 29.84,19.05 30.28,19.05 30.48,19.25 | v40.01,14.61 R15.2 40.01,12.06 | R37.2 72.19,39.57 71.12,40.64 68.58,40.64 66.04,43.18 60.64,43.18 56.83,46.99 56.83,53.34 v59.05,55.56 | v69.53,60.01 69.64,60.01 70.48,60.85
  Top 0.61: R35.P$2 70.48,60.85 68.83,60.85 U9.5
  Top 1.143: 71.12,63.18 80.01,70.8
  Top 1.422: R35.P$2 71.12,63.18 | 80.01,70.8 82.55,70.8
  Bottom 0.406: v44.45,66.04 44.45,69.85 45.72,71.12 v50.8,71.12 | v41.27,57.78 38.73,57.78 v37.47,56.52 | v40.01,17.14 v40.01,14.61 | v59.05,55.56 60.64,55.56 63.5,58.42 65.41,58.42 67.63,60.64 68.9,60.64 v69.53,60.01
  pour Top (no thermals): 81.28,71.75 92.71,71.75 92.71,67.94 81.28,67.94
VMID  (via drill 0.3, 0.4)
  Top 0.406: U4.10 33.97,10.48 v34.61,10.48 | v49.53,10.16 v54.61,10.16
  Bottom 0.406: v34.61,10.48 35.24,10.48 37.78,8.26 46.67,8.26 48.58,10.16 v49.53,10.16 | v54.61,10.16 X3.2
VSC_IN
  Top 0.305: U5.6 25.57,17 26.04,17.46 28.26,17.46 29.21,16.51 36.83,16.51 37.47,15.88 37.47,12.7
  pour Top (no thermals): 32.22,10.95 32.22,13.34 39.05,13.34 39.05,7.62 42.23,7.62 42.23,5.71 36.83,5.71 36.83,10.48 35.24,10.48 35.24,10.95
VSOLAR
  Top 0.254: 48.26,76.2 X7.2
  Top 1.422: X1.4 83.82,76.21 83.82,76.2 48.26,76.2
  pour Top (no thermals): 81.28,76.83 92.71,76.83 92.71,73.03 81.28,73.03
VSUPERCAP  (via drill 0.4, 0.6, 0.8)
  Top 0.406: v90.17,60.96 90.17,41.91 88.9,40.64 88.9,34.29 88.9,30.48 87.63,29.21 v78.74,29.21 | X3.1 52.07,17.14 53.02,16.19 66.99,16.19 68.26,17.46 71.75,17.46 73.34,19.05 75.25,19.05 75.56,19.37 75.56,25.08 75.56,26.04 v76.2,26.67
  Top 0.813: 20.32,12.7 21.59,13.97 | v45.72,5.08 45.72,3.81 44.77,2.86 19.05,2.86 17.78,4.13 17.78,14.92
  Bottom 0.406: X1.13 83.81,63.51 85.09,62.23 88.9,62.23 v90.17,60.96 | v76.2,26.67 v78.74,29.21
  Bottom 0.813: v45.72,5.08 46.99,5.08 52.07,10.16 X3.1
  pour Top (no thermals): 17.13,9.68 21.94,9.68 21.94,13.06 25,13.06 25,10.97 28.71,10.97 28.71,12.9 26.13,12.9 26.13,15.33 17.13,15.33

### Text on the board
Top: NI+ | NI+ | NI- | RMF | VSOL | SW1 | VBUS | SW2 | GND | GND | SUP | MID | GND | BAT | GND
tStop: NI+ | NI+ | NI- | RMF | VSOL | SW1 | VBUS | SW2 | GND | GND | SUP | MID | GND | BAT | GND